# EAGLE design GBASP USB-C (EAGLE 6.2)
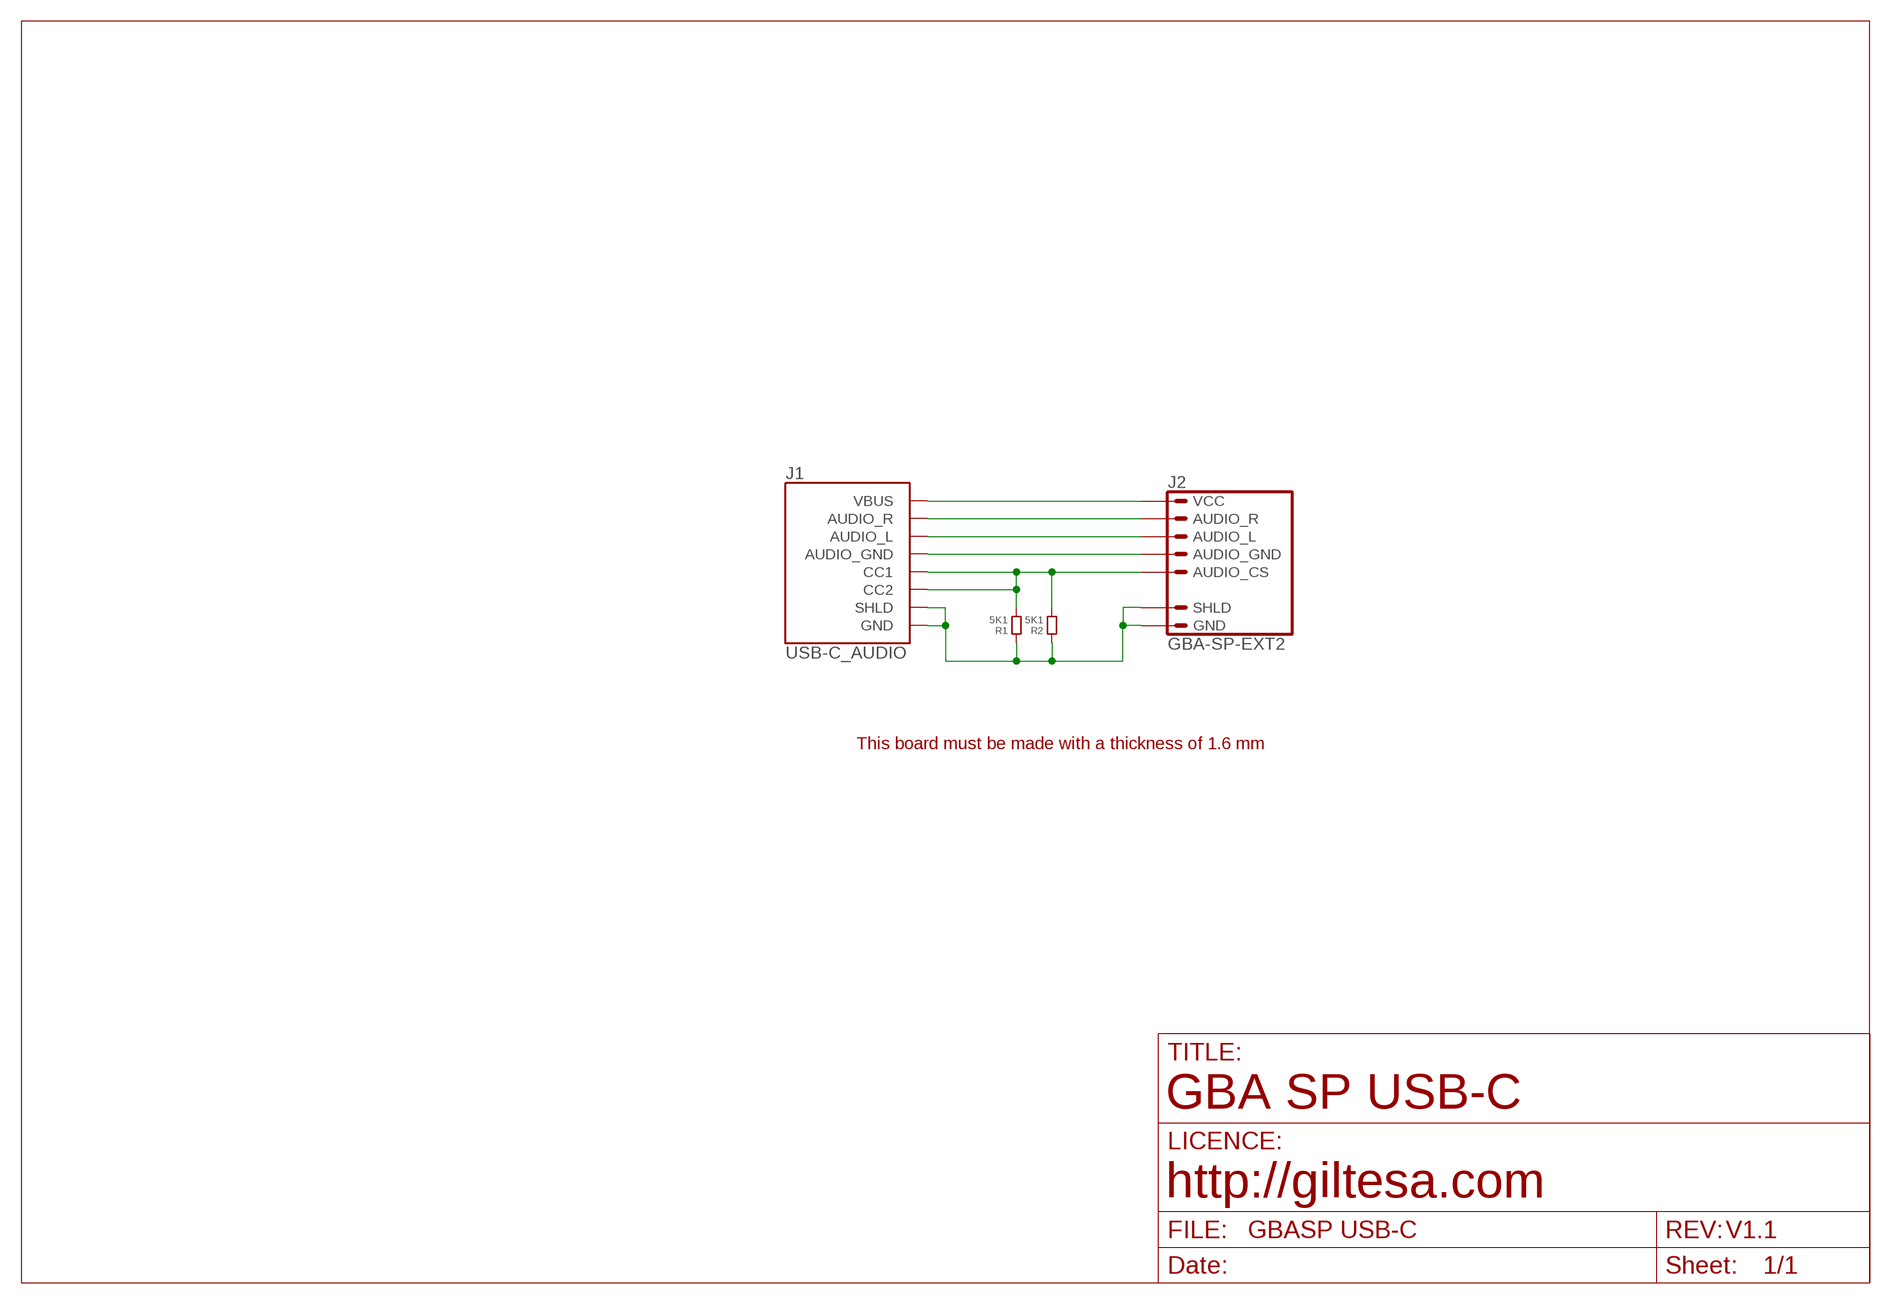
[diagram p0: schematic, sheet 1]

## Parts
J1  USB-C_AUDIO  USB-C_POWER_AUDIOGBASP  [USB-C_16P_3SHLD]
J2  GBA-SP-EXT2  [GBA-SP-EXT2]
R1  5K1  RESISTOR.0402  [0402]
R2  5K1  RESISTOR.0402  [0402]

## Nets
AUDIO_GND: J1.A8(AUDIO_GND) J1.B8(AUDIO_GND) J2.AUDIO_GND
AUDIO_L: J1.A7(AUDIO_L) J1.B7(AUDIO_L) J2.AUDIO_L
AUDIO_R: J1.A6(AUDIO_R) J1.B6(AUDIO_R) J2.AUDIO_R
CC2: J1.A5(CC1) J1.B5(CC2) J2.AUDIO_CS R1.2 R2.2
GND: J1.GND J1.GND2(GND) J1.SHLD1(SHLD) J1.SHLD3(SHLD) J1.SHLD4(SHLD) J1.SHLD5(SHLD) J1.SHLD6(SHLD) J1.SHLD7(SHLD) J1.SHLD8(SHLD) J2.GND J2.SHLD1(SHLD) J2.SHLD2(SHLD) J2.SHLD3(SHLD) J2.SHLD4(SHLD) R1.1 R2.1
VCC: J1.VBUS1(VBUS) J1.VBUS2(VBUS) J2.VCC

## Notes on the sheet
- This board must be made with a thickness of 1.6 mm
- GBA SP USB-C
- http://giltesa.com
- V1.1

## Library data of the parts
J1 = ,giltesa:USB-C_POWER_AUDIO
J2 = ,giltesa:GBA-SP-EXT2
R1 R2 = standardparts:RESISTOR

## Net classes
1 power: width 0.61 mm, drill 0.406 mm, clearance 0.203 mm
2 gnd: width 0.305 mm, drill 0.406 mm, clearance 0.203 mm
3 power usb: width 0.508 mm, drill 0.406 mm, clearance 0.203 mm

## Board
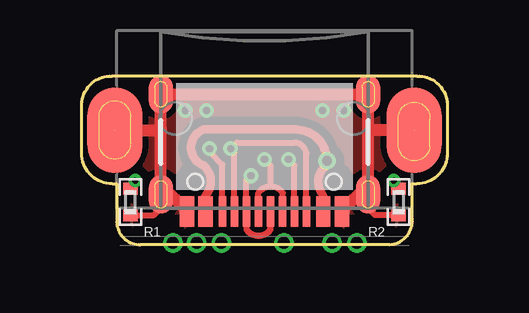
[diagram p1: board, top side]
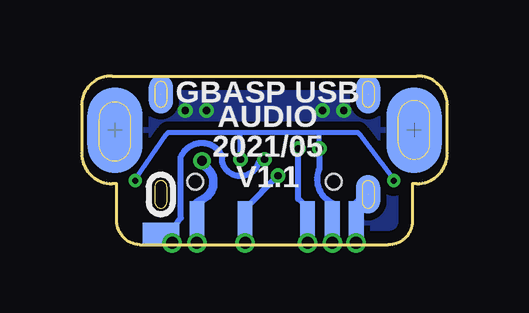
[diagram p2: board, bottom side, seen from below]

Size 15.24 x 7.02 mm. Coordinates in mm from the lower left corner, seen from the top.
Outline: 12.83,0 arc90 13.78,1.07 13.78,2.54 13.97,2.54 arc90 15.24,3.81 15.24,5.84 arc90 13.97,7.02 1.27,7.02 arc90 0,5.84 0,3.81 arc90 1.27,2.54 1.46,2.54 1.46,0.94 arc90 2.46,0 12.83,0
Copper layers (1*16): Top 0.035mm / dielectric 1.6mm / Bottom 0.035mm
Design rules: minimum track width 6mil, minimum drill 12mil, track to track 6mil, track to pad 6mil, pad to pad 6mil, via to via 8mil, smd to smd 0mil, copper to edge 20mil, drill to drill 10mil, minimum pad ring 6mil, minimum via ring 6mil, stop-mask expansion 0mil, vias tented up to drill 100mil, thermal gap 10mil
tRestrict: area 2.5,0.5 to 3.6,1; area 11.7,0.5 to 12.7,1

### Footprints (pad centres in the part's own frame; a part is rotated, then mirrored left to right if it is on the bottom)
USB-C_16P_3SHLD = smd 0.3 x 1.27: A5 -1.25,0.132; A6 -0.25,0.132; A7 0.25,0.132; A8 1.25,0.132; B5 1.75,0.132; B6 0.75,0.132; B7 -0.75,0.132; B8 -1.75,0.132 | smd 0.6 x 1.27: GND -3.225,0.132; GND2 3.225,0.132; VBUS1 -2.45,0.132; VBUS2 2.45,0.132 | smd 1 x 1.6: SHLD1 -4.32,-0.57; SHLD3 4.32,-0.57; SHLD5 4.32,-4.75; SHLD7 -4.32,-4.75 | smd 1 x 1.6 bottom: SHLD4 4.32,-0.57; SHLD6 4.32,-4.75; SHLD8 -4.32,-4.75 | hole 0.65: -2.89,-1.1; 2.89,-1.1
GBA-SP-EXT2 = smd 0.61 x 1.778 bottom: AUDIO_CS -2.826,-0.607; AUDIO_GND -1.797,-0.607; AUDIO_R 0.806,-0.607; GND -3.823,-0.607; VCC 2.819,-0.607 | smd 1.524 x 0.889 bottom: AUDIO_L 4.312,-1.051 | smd 2.286 x 3.556: SHLD1 -6.236,3.251; SHLD3 6.236,3.251 | smd 2.286 x 3.556 bottom: SHLD2 -6.236,3.251; SHLD4 6.236,3.251
0402 = smd 0.5 x 0.6: 1 -0.55,0; 2 0.55,0

### Placement (x,y rotation side)
J1  7.62,1.52 180 top
J2  7.62,1.52 0 top
R1  2.03,1.78 90 top
R2  13.21,1.78 90 top

### Tracks (layer width: path | path; a pad name or v marks a point on that pad's centre or on a via)
AUDIO_GND  (via drill 0.3)
  Top 0.254: J1.A8 6.37,3.84 v6.21,4 6.46,4.25 8.89,4.25 arc-80 9.37,3.77 J1.B8
  Bottom 0.254: 5.82,1.12 J2.AUDIO_GND 5.82,1.51 6.22,1.91 6.22,3.99 v6.21,4
AUDIO_L  (via drill 0.3)
  Top 0.127: 7.87,2.44 7.65,2.44 7.37,2.16
  Top 0.254: J1.A7 7.37,2.16 arc-110 8.38,2.16 8.38,1.39 J1.B7 | 7.87,2.44 7.87,3.3 v7.62,3.56
  Bottom 0.254: J2.AUDIO_L 11.58,0.41 11.1,1.12 11.1,3.68 arc130 9.37,3.68 9.37,3.43 arc-150 7.87,3.43 v7.62,3.56
AUDIO_R  (via drill 0.3)
  Top 0.254: J1.B6 6.87,0.89 | 6.87,0.89 6.87,0.64 arc110 7.87,0.64 J1.A6 | 6.87,0.89 6.86,0.9 6.86,2.67 v7.06,2.87
  Bottom 0.254: J2.AUDIO_R 8.43,1.51 v7.06,2.87
CC2  (via drill 0.25, 0.3)
  Top 0.203: R1.2 2.03,2.41 v2.24,2.67 | R2.2 13.21,2.41 v13,2.67
  Top 0.254: J1.B5 5.87,3.34 5.33,3.87 v5.33,4 | v8.62,3.56 8.87,3.31 J1.A5
  Bottom 0.203: v2.24,2.67 2.29,2.79 3.66,4.6 3.73,4.67 5.26,4.67 | v13,2.67 12.95,2.79 11.71,4.6 11.63,4.67 8.64,4.67 | 5.26,4.67 8.64,4.67 | v5.33,4 5.33,4.62 5.26,4.67 | v8.62,3.56 8.62,4.66 8.64,4.67
  Bottom 0.254: J2.AUDIO_CS 4.79,1.75 arc90 5.33,3.17 v5.33,4
GND  (via drill 0.3)  (5 unrouted)
  Top 0.254: R1.1 3.01,1.23 3.3,1.52 J1.SHLD4 | R2.1 12.23,1.23 12.07,1.4 12.07,1.97 J1.SHLD1
  Top 0.508: J1.SHLD6 3.48,6.1 | 11.76,6.1 arc90 J1.SHLD7 | 3.3,4.83 J1.SHLD4 3.69,2.09 J1.GND2 | 3.3,4.83 J1.SHLD6 | J2.SHLD2 3.25,4.78 3.3,4.83 | 11.94,4.83 J1.SHLD1 11.55,2.09 J1.GND | 11.94,4.83 J1.SHLD7 | J2.SHLD4 11.99,4.78 11.94,4.83 | J1.SHLD6 J1.SHLD7
  Bottom 0.508: J2.GND 3.8,1.6 J1.SHLD4
  other vias: 5.21,5.59 10.03,5.59 10.92,5.59 4.32,5.59
  pour Top (isolate 0.356): -0.64,7.87 15.88,7.87 15.88,-1.02 -0.64,-1.02
  pour Bottom (isolate 0.356): -0.64,7.87 15.88,7.87 15.88,-1.02 -0.64,-1.02
N$1  (via drill 0.51)
  other vias: 3.8,0.08
N$2  (via drill 0.51)
  other vias: 4.79,0.08
N$3  (via drill 0.51)
  other vias: 5.82,0.08
N$4  (via drill 0.51)
  other vias: 8.43,0.08
N$5  (via drill 0.51)
  other vias: 10.44,0.08
N$6  (via drill 0.51)
  other vias: 11.47,0.08
VCC  (via drill 0.41)
  Top 0.356: J1.VBUS2 5.12,1.41 5.23,1.52 5.08,1.52 5.08,1.78 5.11,1.93 5.23,2.13 arc80 5.11,3.28 5.08,3.3 arc-140 5.08,4.8 8.91,4.8 arc-90 v10.22,3.49 10.16,3.28 arc80 9.98,2.18 10.1,1.97 J1.VBUS1
  Bottom 0.356: J2.VCC 10.44,1.75 10.13,1.93 arc-120 10.13,3.28 v10.22,3.49
  Bottom 0.406: 10.35,0.75 J2.VCC

### Text on the board
bPlace: GBASP USB | AUDIO | 2021/05 | V1.1
Document: JLCJLCJLCJLC